# EAGLE schematic Eddy_ESC (EAGLE 9.5.2)

## Sheet 1 of 2: Connectors
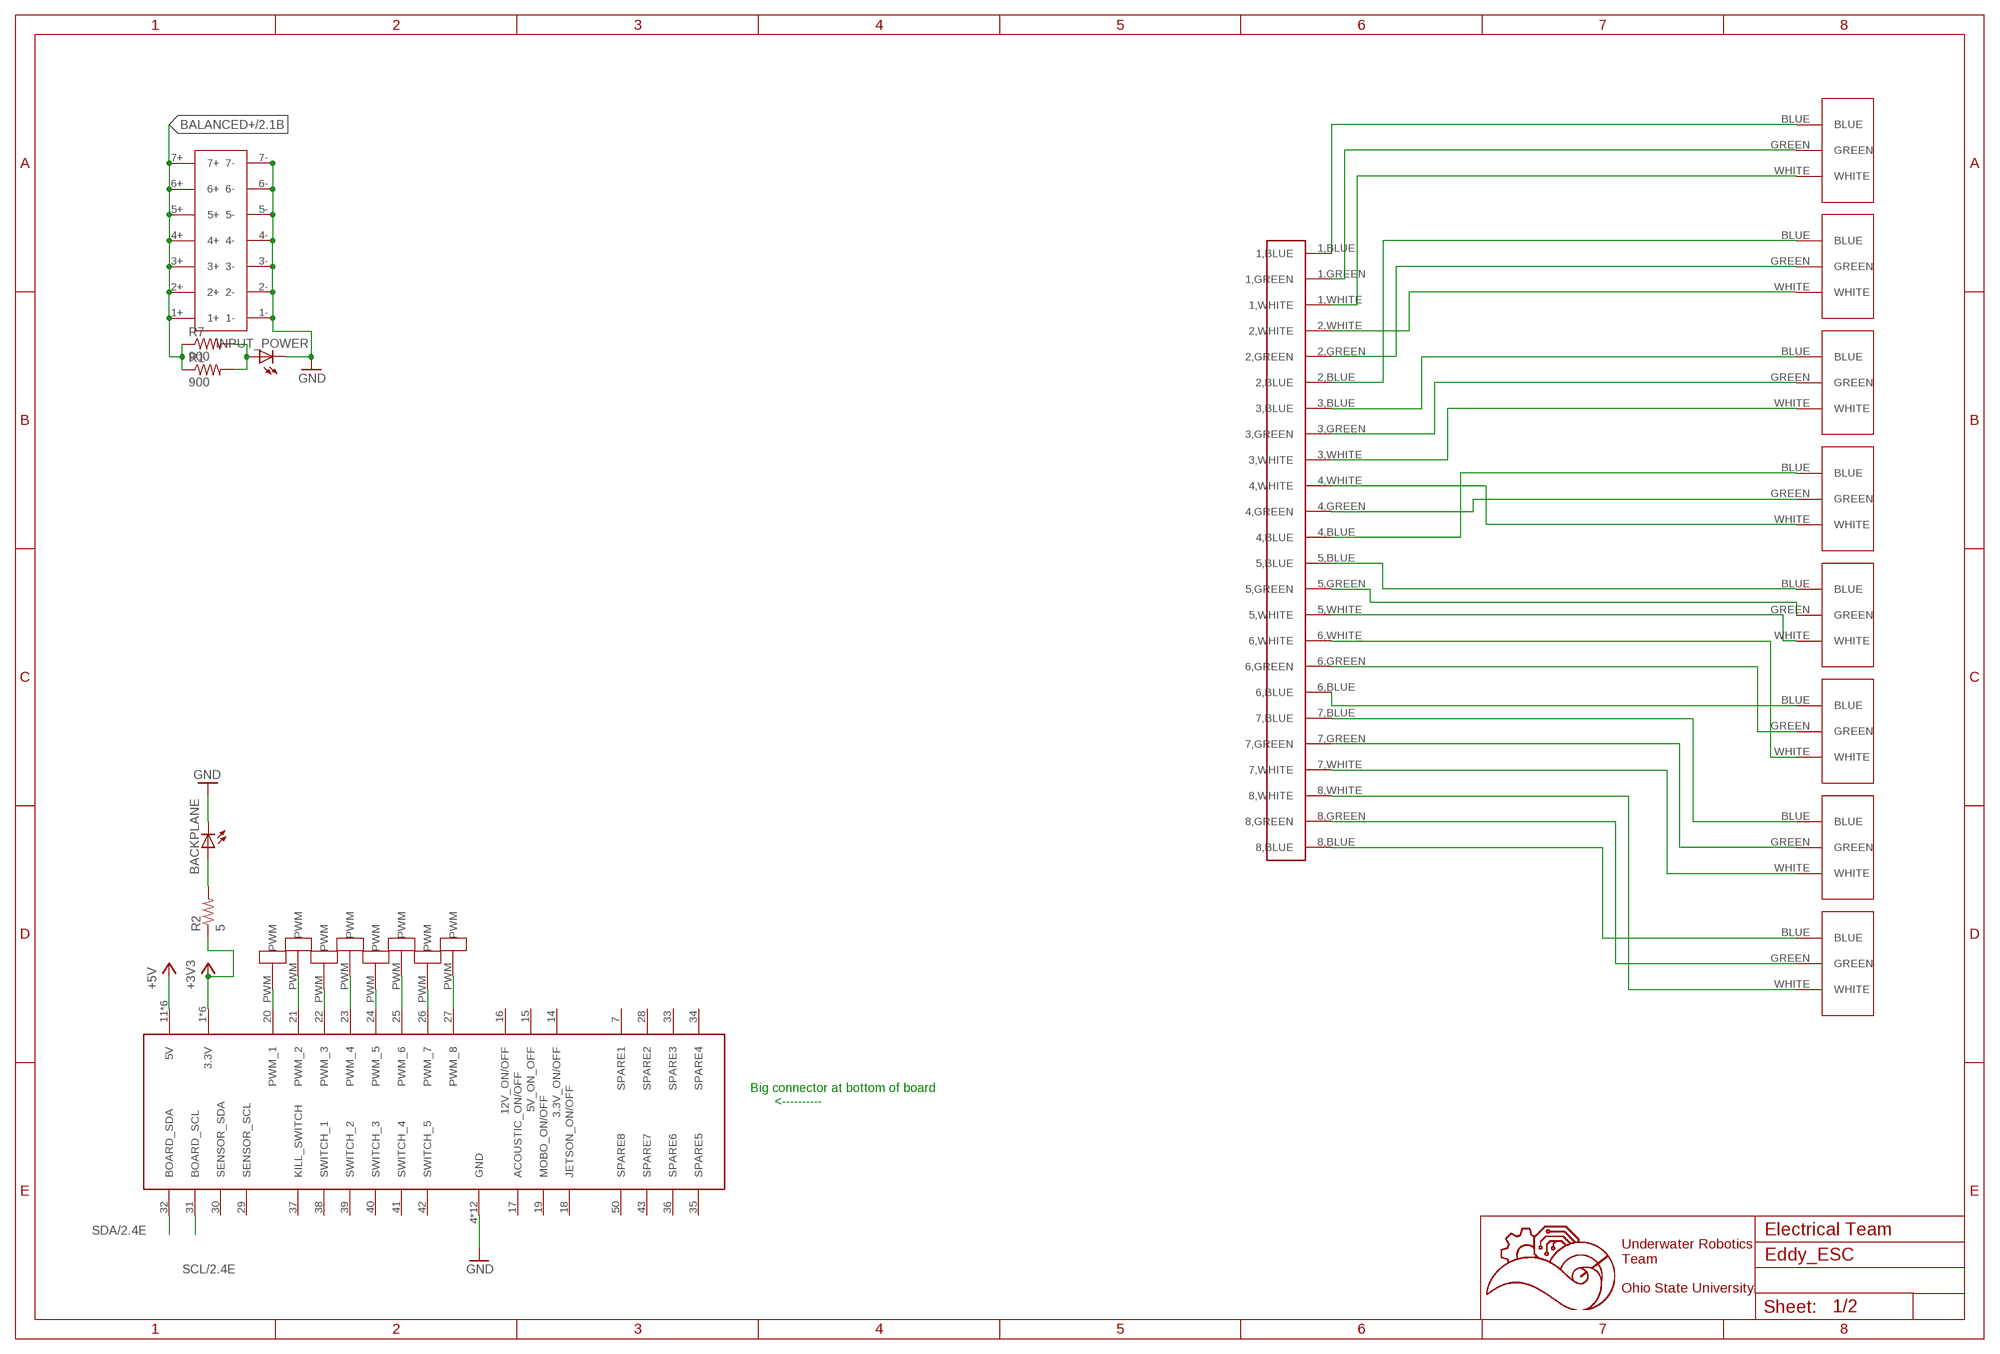
[diagram p0: schematic, sheet 1]

### Parts
BACKPLANE  LEDCHIPLED_0603  [CHIPLED_0603]
INPUT_POWER  LEDCHIPLED_0603  [CHIPLED_0603]
R1  900  R-US_R0603  [R0603]
R2  5  R-US_R0603  [R0603]
R7  900  R-US_R0603  [R0603]
U$1  5530843-EDGE  [5530843-6-BOARDFINGERS]
U$2  1711738  [1711738]
U$3  1711738  [1711738]
U$4  1711738  [1711738]
U$5  1711738  [1711738]
U$6  1711738  [1711738]
U$7  1711738  [1711738]
U$8  1711738  [1711738]
U$9  1711738  [1711738]
U$10  24PINCONVERTER  [24PINCONVERTER]
U$11  14PIN_VERT  [14PIN_VERT]
U$12  MALE1PINHEADER  [MALE1PINHEADER]
U$13  MALE1PINHEADER  [MALE1PINHEADER]
U$14  MALE1PINHEADER  [MALE1PINHEADER]
U$15  MALE1PINHEADER  [MALE1PINHEADER]
U$16  MALE1PINHEADER  [MALE1PINHEADER]
U$17  MALE1PINHEADER  [MALE1PINHEADER]
U$18  MALE1PINHEADER  [MALE1PINHEADER]
U$19  MALE1PINHEADER  [MALE1PINHEADER]

### Nets
+3V3: R2.1 U$1.1(3.3V) U$1.2(3.3V) U$1.3(3.3V) U$1.54(3.3V) U$1.55(3.3V) U$1.56(3.3V) ; also sheet 2
+5V: U$1.11(5V) U$1.12(5V) U$1.13(5V) U$1.44(5V) U$1.45(5V) U$1.46(5V)
BALANCED+/2.1B: R1.1 R7.1 U$11.1+ U$11.2+ U$11.3+ U$11.4+ U$11.5+ U$11.6+ U$11.7+
GND: BACKPLANE.C INPUT_POWER.C U$1.4(GND) U$1.5(GND) U$1.6(GND) U$1.8(GND) U$1.9(GND) U$1.10(GND) U$1.47(GND) U$1.48(GND) U$1.49(GND) U$1.51(GND) U$1.52(GND) U$1.53(GND) U$11.1- U$11.2- U$11.3- U$11.4- U$11.5- U$11.6- U$11.7- ; also sheet 2
N$1: U$9.BLUE U$10.1,BLUE
N$2: U$9.GREEN U$10.1,GREEN
N$3: U$9.WHITE U$10.1,WHITE
N$4: U$2.BLUE U$10.2,BLUE
N$5: U$2.WHITE U$10.2,WHITE
N$6: U$2.GREEN U$10.2,GREEN
N$7: U$3.BLUE U$10.3,BLUE
N$8: U$3.GREEN U$10.3,GREEN
N$9: U$3.WHITE U$10.3,WHITE
N$10: U$4.BLUE U$10.4,BLUE
N$11: U$4.GREEN U$10.4,GREEN
N$12: U$4.WHITE U$10.4,WHITE
N$13: U$5.BLUE U$10.5,BLUE
N$14: U$5.GREEN U$10.5,GREEN
N$15: U$5.WHITE U$10.5,WHITE
N$16: U$6.WHITE U$10.6,WHITE
N$17: U$6.GREEN U$10.6,GREEN
N$18: U$6.BLUE U$10.6,BLUE
N$19: U$7.BLUE U$10.7,BLUE
N$20: U$7.GREEN U$10.7,GREEN
N$21: U$7.WHITE U$10.7,WHITE
N$22: U$8.WHITE U$10.8,WHITE
N$23: U$8.GREEN U$10.8,GREEN
N$24: U$8.BLUE U$10.8,BLUE
N$25: U$1.20(PWM_1) U$12.PWM
N$26: U$1.21(PWM_2) U$13.PWM
N$27: U$1.22(PWM_3) U$14.PWM
N$28: U$1.23(PWM_4) U$16.PWM
N$29: U$1.24(PWM_5) U$15.PWM
N$30: U$1.25(PWM_6) U$17.PWM
N$31: U$1.26(PWM_7) U$18.PWM
N$32: U$1.27(PWM_8) U$19.PWM
N$33: INPUT_POWER.A R1.2 R7.2
N$34: BACKPLANE.A R2.2
SCL/2.4E: U$1.31(BOARD_SCL)
SDA/2.4E: U$1.32(BOARD_SDA)
Unconnected: U$1.7(SPARE1) U$1.14(3.3V_ON/OFF) U$1.15(5V_ON_OFF) U$1.16(12V_ON/OFF) U$1.17(ACOUSTIC_ON/OFF) U$1.18(JETSON_ON/OFF) U$1.19(MOBO_ON/OFF) U$1.28(SPARE2) U$1.29(SENSOR_SCL) U$1.30(SENSOR_SDA) U$1.33(SPARE3) U$1.34(SPARE4) U$1.35(SPARE5) U$1.36(SPARE6) U$1.37(KILL_SWITCH) U$1.38(SWITCH_1) U$1.39(SWITCH_2) U$1.40(SWITCH_3) U$1.41(SWITCH_4) U$1.42(SWITCH_5) U$1.43(SPARE7) U$1.50(SPARE8)

### Notes on the sheet
- Big connector at bottom of board
         <----------
- Electrical Team
- Underwater Robotics
  Team
  
  Ohio State University

## Sheet 2 of 2
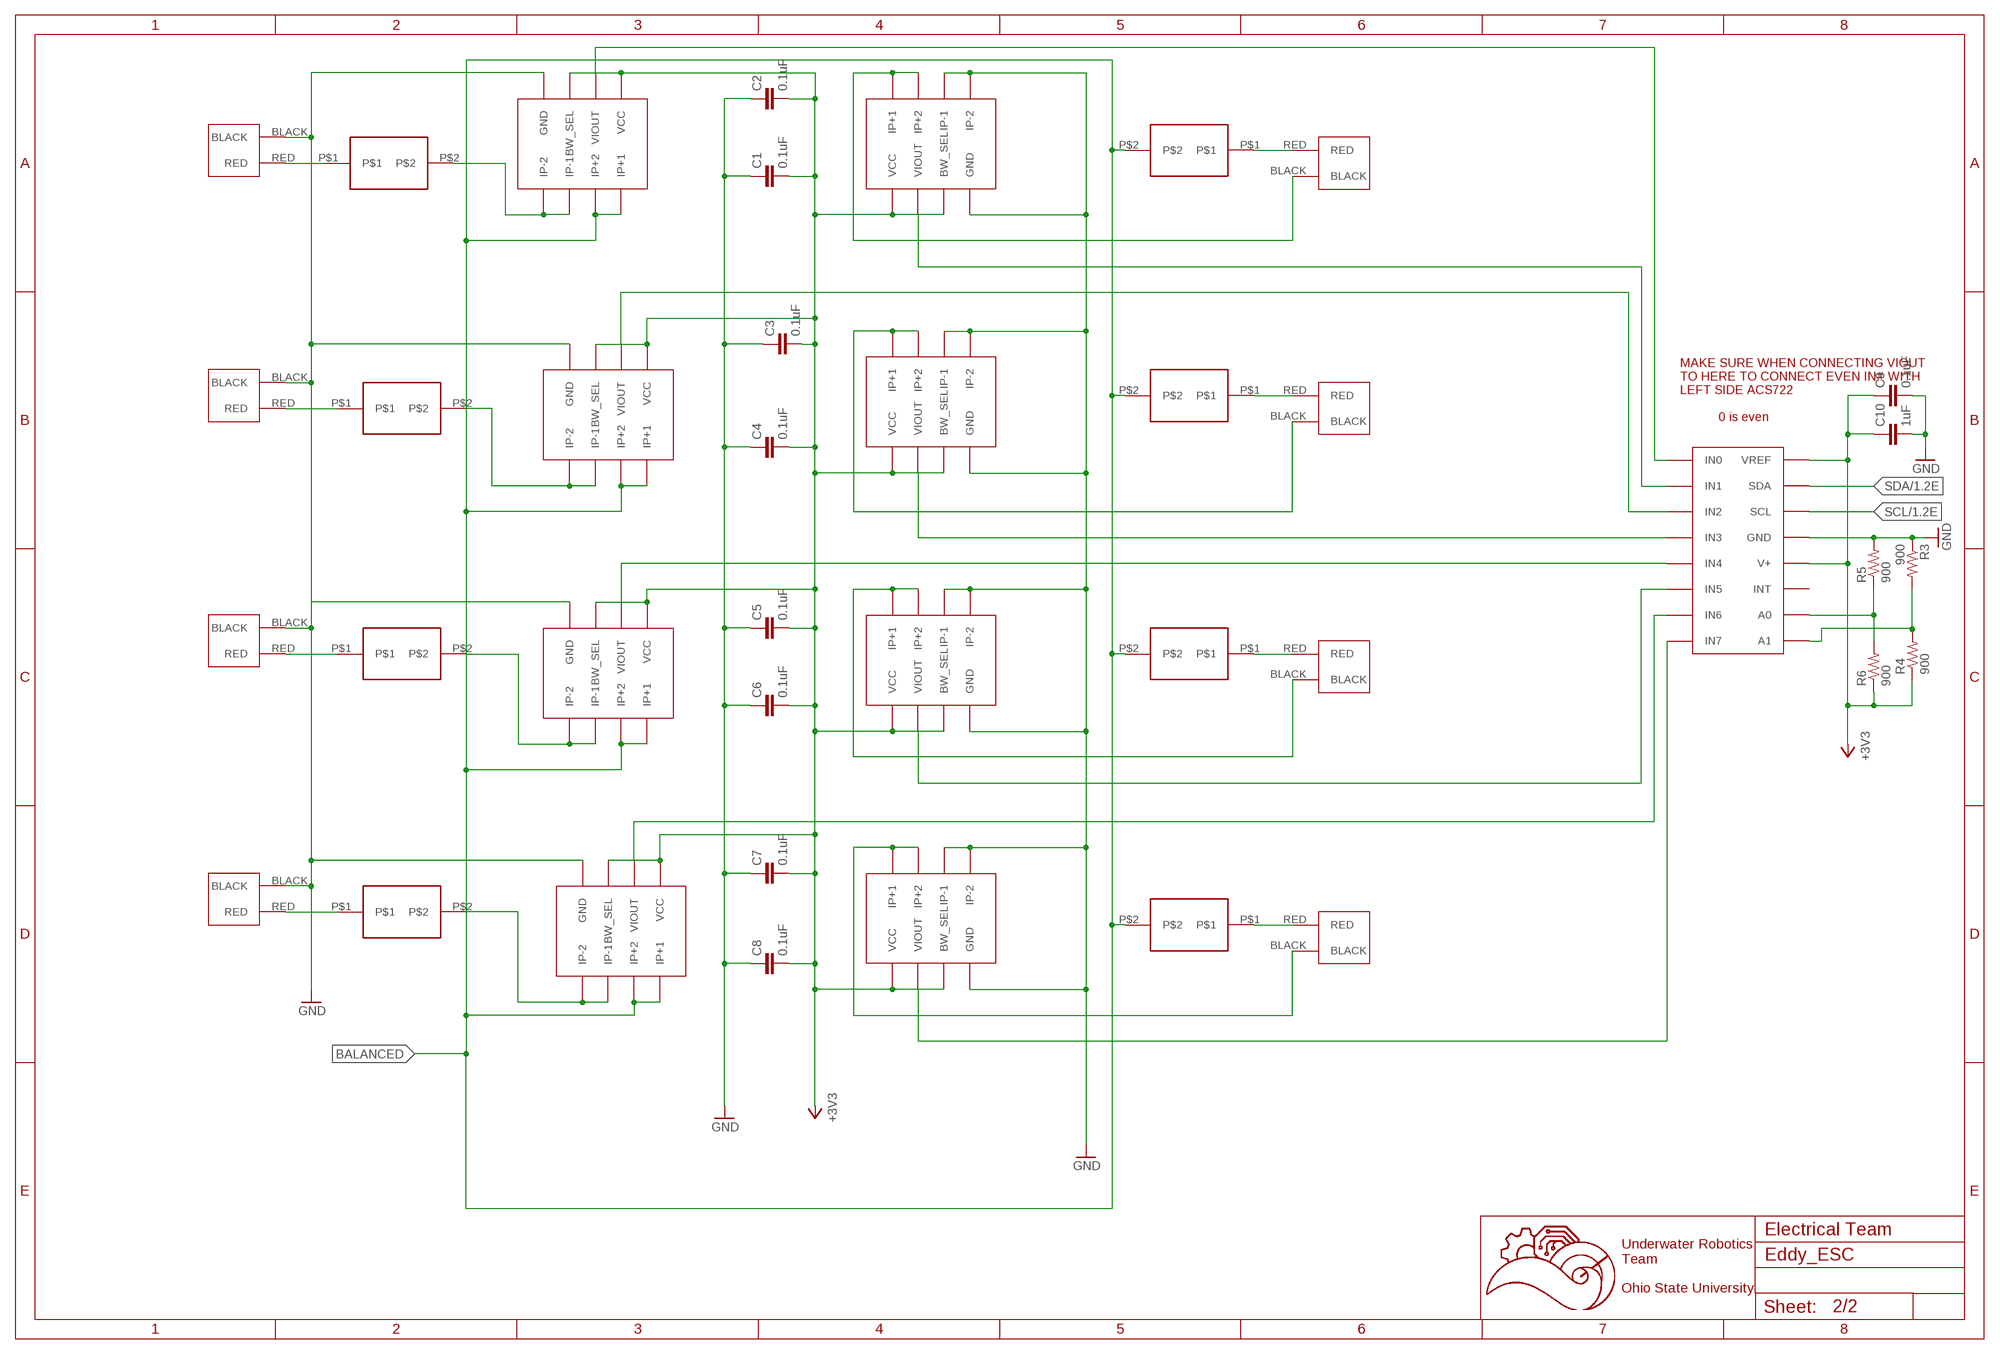
[diagram p1: schematic, sheet 2]

### Parts
C1  0.1uF  C-EUC0603  [C0603]
C2  0.1uF  C-EUC0603  [C0603]
C3  0.1uF  C-EUC0603  [C0603]
C4  0.1uF  C-EUC0603  [C0603]
C5  0.1uF  C-EUC0603  [C0603]
C6  0.1uF  C-EUC0603  [C0603]
C7  0.1uF  C-EUC0603  [C0603]
C8  0.1uF  C-EUC0603  [C0603]
C9  0.1uF  C-EUC0603  [C0603]
C10  1uF  C-EUC0603  [C0603]
R3  900  R-US_R0603  [R0603]
R4  900  R-US_R0603  [R0603]
R5  900  R-US_R0603  [R0603]
R6  900  R-US_R0603  [R0603]
U$20  1711725  [1711725]
U$21  1711725  [1711725]
U$22  1711725  [1711725]
U$23  1711725  [1711725]
U$24  1711725  [1711725]
U$25  1711725  [1711725]
U$26  1711725  [1711725]
U$27  1711725  [1711725]
U$28  ACS722  [SOIC-8]
U$29  ACS722  [SOIC-8]
U$30  ACS722  [SOIC-8]
U$31  ACS722  [SOIC-8]
U$32  ACS722  [SOIC-8]
U$33  ACS722  [SOIC-8]
U$34  ACS722  [SOIC-8]
U$35  ACS722  [SOIC-8]
U$36  ADC128D818  [TSSOP-16]
U$37  1206SFH  [1206SFH]
U$38  1206SFH  [1206SFH]
U$39  1206SFH  [1206SFH]
U$40  1206SFH  [1206SFH]
U$41  1206SFH  [1206SFH]
U$42  1206SFH  [1206SFH]
U$43  1206SFH  [1206SFH]
U$44  1206SFH  [1206SFH]

### Nets
+3V3: C1.2 C2.2 C3.2 C4.2 C5.2 C6.2 C7.2 C8.2 C9.1 C10.1 R4.1 R6.1 U$28.BW_SEL U$28.VCC U$29.BW_SEL U$29.VCC U$30.BW_SEL U$30.VCC U$31.BW_SEL U$31.VCC U$32.BW_SEL U$32.VCC U$33.BW_SEL U$33.VCC U$34.BW_SEL U$34.VCC U$35.BW_SEL U$35.VCC U$36.V+ U$36.VREF ; also sheet 1
BALANCED: U$32.IP+1 U$32.IP+2 U$33.IP+1 U$33.IP+2 U$34.IP+1 U$34.IP+2 U$35.IP+1 U$35.IP+2 U$41.P$2 U$42.P$2 U$43.P$2 U$44.P$2
GND: C1.1 C2.1 C3.1 C4.1 C5.1 C6.1 C7.1 C8.1 C9.2 C10.2 R3.1 R5.2 U$24.BLACK U$25.BLACK U$26.BLACK U$27.BLACK U$28.GND U$28.IP-1 U$28.IP-2 U$29.GND U$29.IP-1 U$29.IP-2 U$30.GND U$30.IP-1 U$30.IP-2 U$31.GND U$31.IP-1 U$31.IP-2 U$32.GND U$33.GND U$34.GND U$35.GND U$36.GND ; also sheet 1
N$35: U$20.BLACK U$28.IP+1 U$28.IP+2
N$36: U$21.BLACK U$29.IP+1 U$29.IP+2
N$37: U$34.VIOUT U$36.IN4
N$38: U$29.VIOUT U$36.IN3
N$39: U$22.BLACK U$30.IP+1 U$30.IP+2
N$40: U$33.IP-1 U$33.IP-2 U$38.P$2
N$41: U$34.IP-1 U$34.IP-2 U$39.P$2
N$42: U$31.VIOUT U$36.IN7
N$43: U$35.VIOUT U$36.IN6
N$45: U$30.VIOUT U$36.IN5
N$46: U$32.IP-1 U$32.IP-2 U$37.P$2
N$47: U$35.IP-1 U$35.IP-2 U$40.P$2
N$48: U$33.VIOUT U$36.IN2
N$49: U$28.VIOUT U$36.IN1
N$50: U$32.VIOUT U$36.IN0
N$51: U$24.RED U$37.P$1
N$52: U$25.RED U$38.P$1
N$53: U$26.RED U$39.P$1
N$54: U$27.RED U$40.P$1
N$55: U$20.RED U$41.P$1
N$56: U$21.RED U$42.P$1
N$57: U$22.RED U$43.P$1
N$58: U$23.RED U$44.P$1
N$59: R5.1 R6.2 U$36.A0
N$60: R3.2 R4.2 U$36.A1
N$61: U$23.BLACK U$31.IP+1 U$31.IP+2
SCL/1.2E: U$36.SCL
SDA/1.2E: U$36.SDA
Unconnected: U$36.INT

### Notes on the sheet
- MAKE SURE WHEN CONNECTING VIOUT 
  TO HERE TO CONNECT EVEN IN# WITH 
  LEFT SIDE ACS722
  
             0 is even
- Electrical Team
- Underwater Robotics
  Team
  
  Ohio State University

## Library data of the parts
BACKPLANE INPUT_POWER = led:LED: LED OSRAM: - CHIPLED LG R971, LG N971, LY N971, LG Q971, LY Q971, LO R971, LY R971 LH N974, LH R974 LS Q976, LO Q976, LY Q976 LO Q996 - Hyper CHIPLED LW Q18S LB Q993, LB Q99A, LB R99A - SideLED LS A670, LO A670, LY A670, LG A670, LP A670 LB A673, LV A673, LT A673, LW A673 LH A674 LY A675 LS A676, LA A676, LO A676, LY A676, LW A676 LS A679, LY A679, LG A679 - Hyper Micro SIDELED® LS Y876, LA Y876, LO Y876, LY Y876 LT Y87S - SmartLED LW L88C, LW L88S LB L89C, LB L89S, LG L890 LS L89K, LO L89K, LY L89K LS L896, LA L896, LO L896, LY L896 - TOPLED LS T670, LO T670, LY T670, LG T670, LP T670 LSG T670, LSP T670, LSY T670, LOP T670, LYG T670 LG T671, LOG T671, LSG T671 LB T673, LV T673, LT T673, LW T673 LH T674 LS T676, LA T676, LO T676, LY T676, LB T676, LH T676, LSB T676, LW T676 LB T67C, LV T67C, LT T67C, LS T67K, LO T67K, LY T67K, LW E67C LS E67B, LA E67B, LO E67B, LY E67B, LB E67C, LV E67C, LT E67C LW T67C LS T679, LY T679, LG T679 LS T770, LO T770, LY T770, LG T770, LP T770 LB T773, LV T773, LT T773, LW T773 LH T774 LS E675, LA E675, LY E675, LS T675 LS T776, LA T776, LO T776, LY T776, LB T776 LHGB T686 LT T68C, LB T68C - Hyper Mini TOPLED® LB M676 - Mini TOPLED Santana® LG M470 LS M47K, LO M47K, LY M47K Source: http://www.osram.convergy.de LUXEON: - LUMILED® LXK2-PW12-R00, LXK2-PW12-S00, LXK2-PW14-U00, LXK2-PW14-V00 LXK2-PM12-R00, LXK2-PM12-S00, LXK2-PM14-U00 LXK2-PE12-Q00, LXK2-PE12-R00, LXK2-PE12-S00, LXK2-PE14-T00, LXK2-PE14-U00 LXK2-PB12-K00, LXK2-PB12-L00, LXK2-PB12-M00, LXK2-PB14-N00, LXK2-PB14-P00, LXK2-PB14-Q00 LXK2-PR12-L00, LXK2-PR12-M00, LXK2-PR14-Q00, LXK2-PR14-R00 LXK2-PD12-Q00, LXK2-PD12-R00, LXK2-PD12-S00 LXK2-PH12-R00, LXK2-PH12-S00 LXK2-PL12-P00, LXK2-PL12-Q00, LXK2-PL12-R00 Source: www.luxeon.com KINGBRIGHT: KA-3528ASYC Source: www.kingbright.com
C1-C10 = rcl:C-EU: CAPACITOR, European symbol; SPICEPREFIX: C
R1-R7 = resistor:R-US_: RESISTOR, American symbol
U$1 = 5530843-6:5530843-EDGE
U$2-U$9 = Screw_Terminals:1711738
U$10 = 24_Pin_Connector:24PINCONVERTER
U$11 = 14_Pin_Connector_Vert:14PIN_VERT
U$12-U$19 = Male_Header_1Pin:MALE1PINHEADER
U$20-U$27 = Screw_Terminals:1711725: 2-pin screw terminal
U$28-U$35 = ACS722:ACS722
U$36 = ADC128D818:ADC128D818
U$37-U$44 = 1206SFH:1206SFH